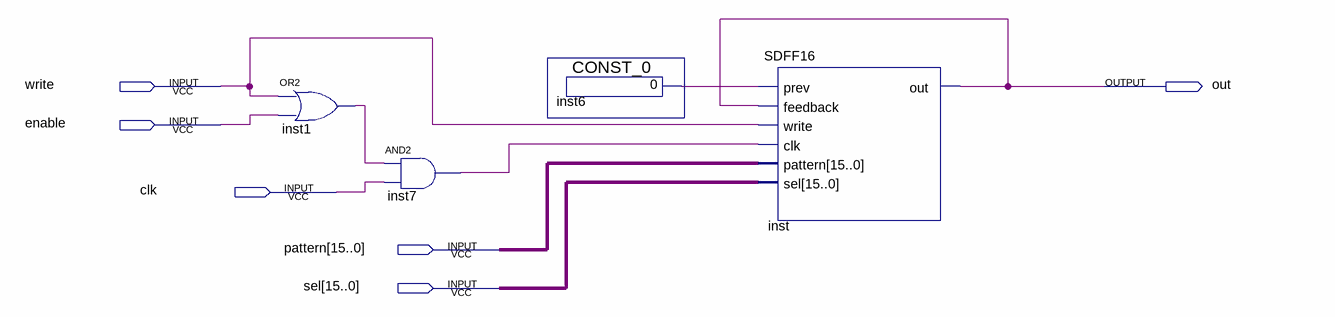
[diagram p0: schematic sheet]
// Quartus schematic PATTERN_CHANNEL.bdf as structural Verilog: 4 symbols, 6 pins
module PATTERN_CHANNEL (
  input  write,
  input  enable,
  input  clk,
  input  [15:0] pattern,
  input  [15:0] sel,
  output out
);

  wire inst1_out, inst6_result, inst7_out;

  or inst1 (inst1_out, write, enable);
  and inst7 (inst7_out, inst1_out, clk);
  CONST_0 inst6 (.result(inst6_result));
  SDFF16 inst (
    .prev(inst6_result), .feedback(out), .write(write), .clk(inst7_out), .pattern(pattern), .sel(sel),
    .out(out));
endmodule
